# EasyEDA Pro project DCP_main.eprj, board PCB1
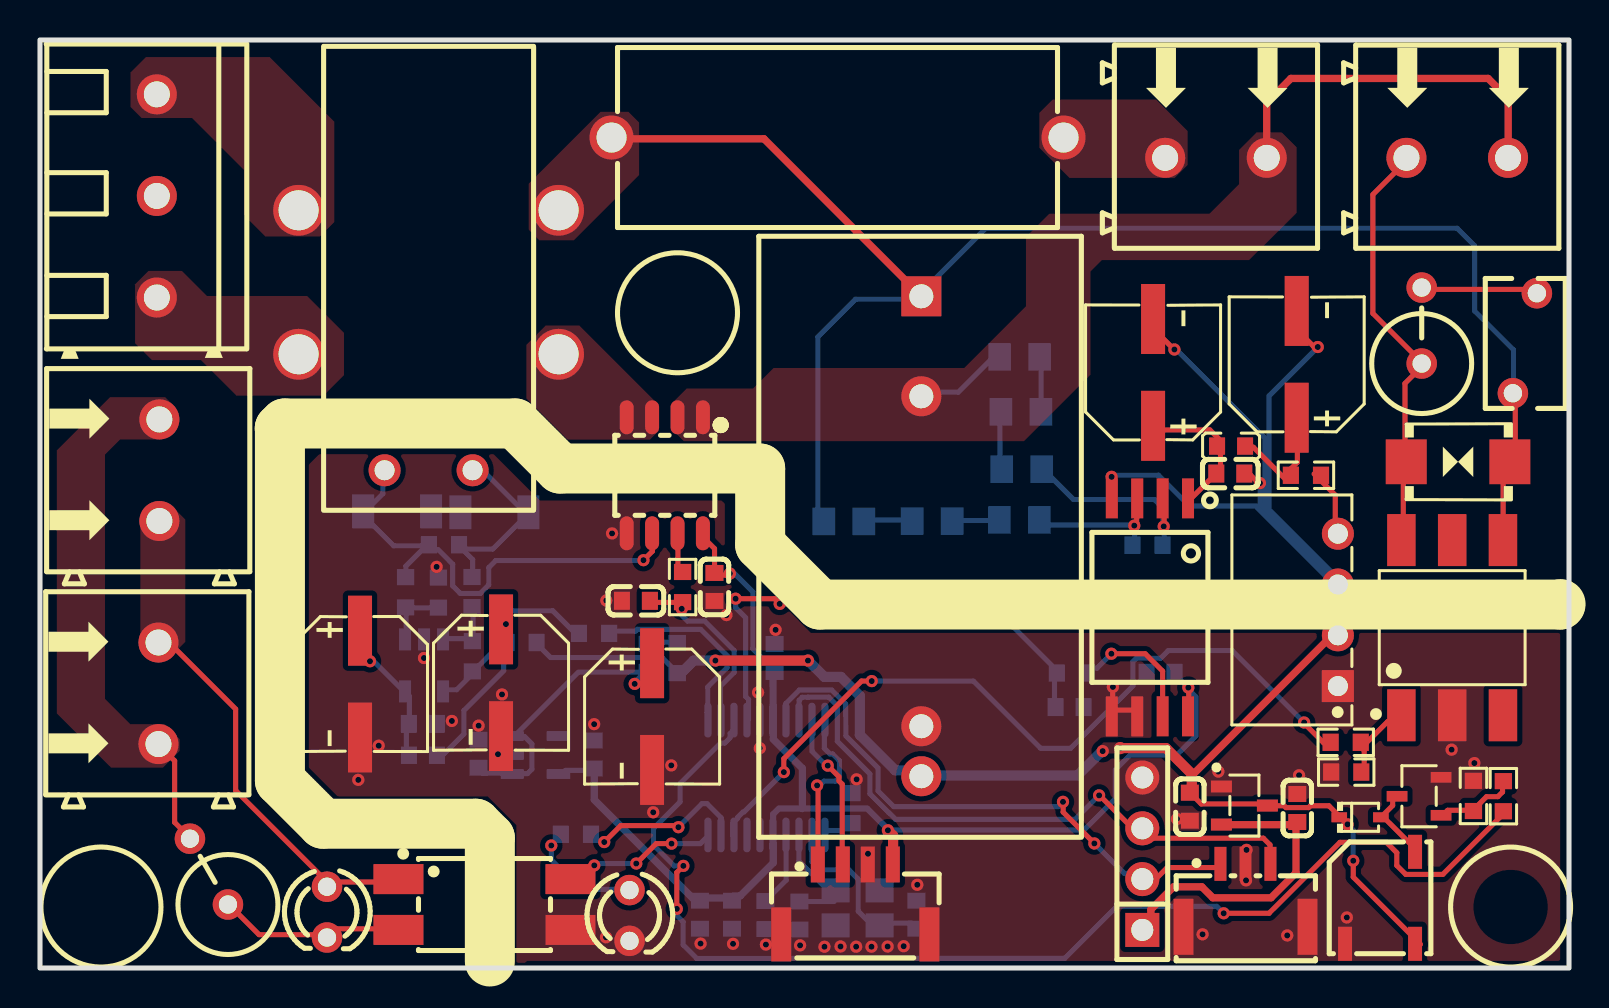
[diagram p2: board, top side]
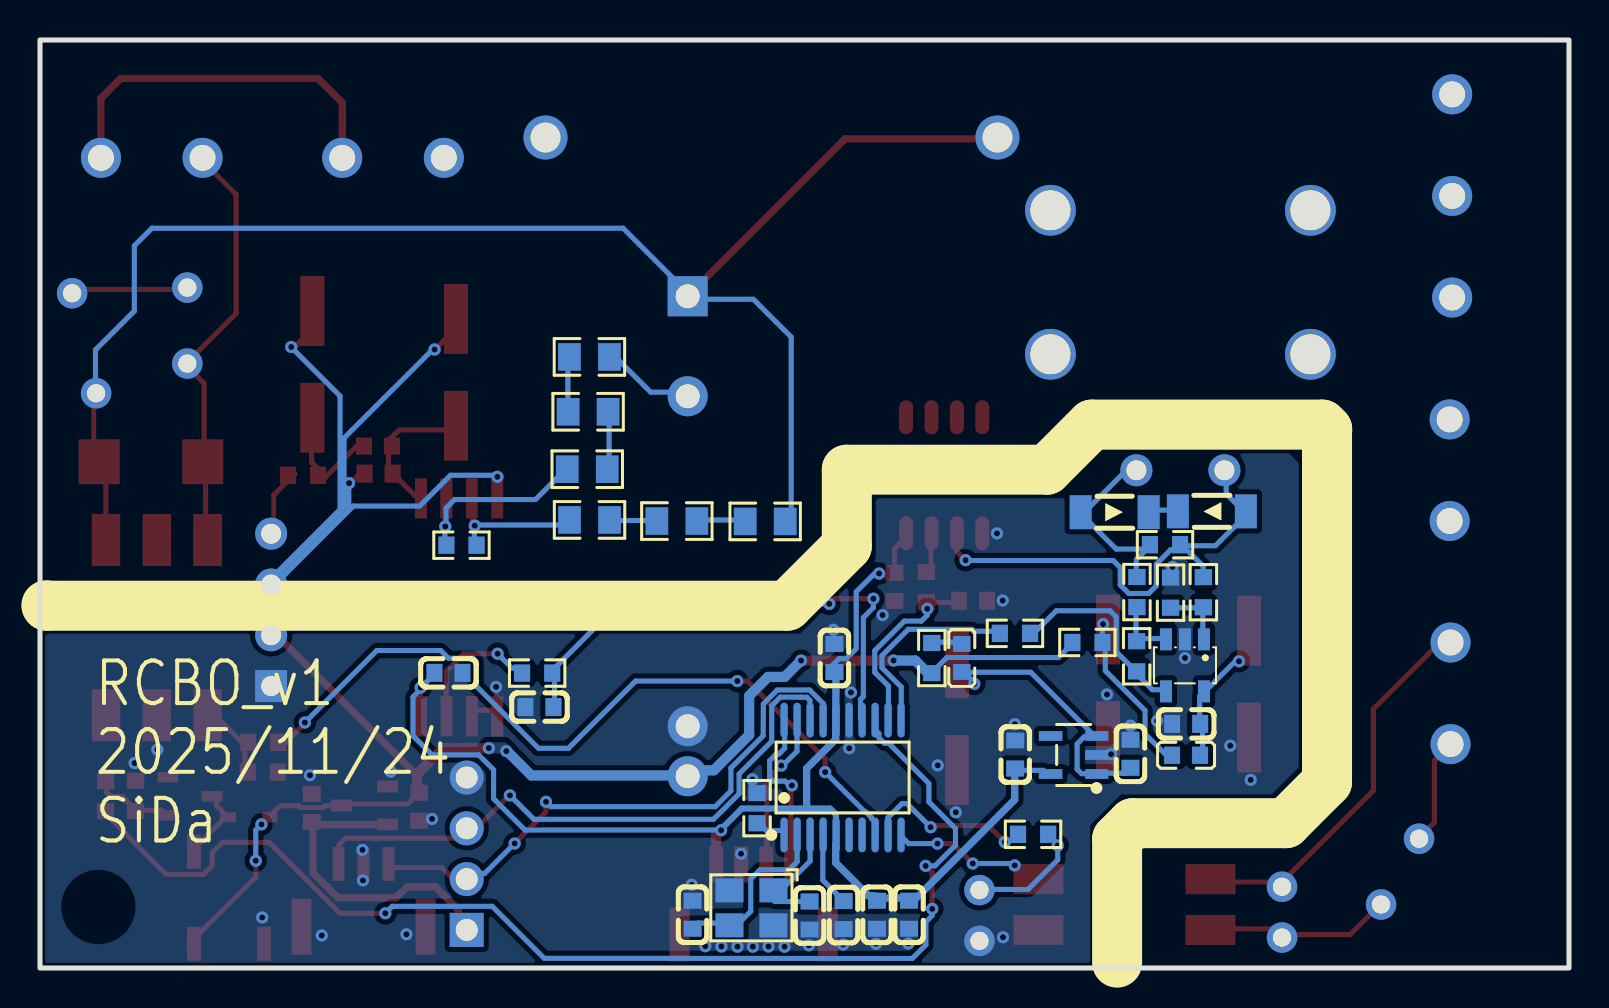
[diagram p3: board, bottom side, seen from below]

Outline 76.45 x 46.41 mm; copper layers: Top Layer, Bottom Layer. Coordinates in mm from the lower left corner of the outline.
Outline path: rectangle 0,46.41 76.45,0
Stack: Top Layer 0.035mm / Dielectric1 1.51mm FR4 er 4.5 / Bottom Layer 0.035mm

## Design rules (mm)
template: 自定义配置
spacing copperThickness1oz (default): track to track 0.102, other pairs 0.152 to 0.3
spacing copperThickness2oz: track to track 0.203, other pairs 0.152 to 0.3
track width copperThickness1oz (default): min 0.127, default 0.254, max 2.54
track width copperThickness2oz: min 0.203, default 0.254, max 2.54
differential pair differentialPair (default): width min 0.127, default 0.254, max 2.54; gap min 0.152, default 0.152
via viaSize (default): diameter min 0.5, default 0.61, max 10; hole min 0.3, default 0.305, max 6.3

## Placement (name value [footprint] x y rotation side)
BLE  -  [HDR-TH_4P-P2.54-V-F]  55.12 5.71 90 top
BUZZER1  4kHz  [BUZ-SMD_L5.0-W5.5-P4.60]  67.01 3.51 90 top
C1  2.2nF  [CAP-TH_L6.5-W4.0-P5.0-D0.5]  74.25 31.24 270 top
C4  100nF  [C0603]  19.14 12.21 0 bottom
C5  100nF  [C0603]  56.03 14.76 0 bottom
C6  220uF  [CAP-SMD_BD6.3-L6.6-W6.6-LS7.4-FD]  62.84 30.19 90 top
C7  220uF  [CAP-SMD_BD6.3-L6.6-W6.6-LS7.4-FD]  55.66 29.78 90 top
C8  220uF  [CAP-SMD_BD6.3-L6.6-W6.6-LS7.4-FD]  23.05 14.26 270 top
C9  220uF  [CAP-SMD_BD6.3-L6.6-W6.6-LS7.4-FD]  16 14.2 270 top
C11  220uF  [CAP-SMD_BD6.3-L6.6-W6.6-LS7.4-FD]  30.61 12.57 270 top
C12  1uF  [C0603]  21.93 10.71 270 bottom
C13  2.2uF  [C0603]  27.69 10.68 270 bottom
C14  100nF  [C0603]  36.28 2.65 90 bottom
C15  20pF  [C0603]  37.97 2.63 90 bottom
C16  20pF  [C0603]  43.82 2.67 270 bottom
C17  100nF  [C0603]  34.6 2.66 270 bottom
C18  4.7uF  [C0603]  33 2.66 270 bottom
C19  100nF  [C0603]  36.73 15.5 270 bottom
C22  100nF  [C0603]  59.52 24.72 0 top
C23  100nF  [C0603]  33.73 19.05 90 top
C24  1nF  [C0603]  29.8 18.36 180 top
C25  1nF  [C0603]  51.48 13.05 0 bottom
C26  10uF  [C0603]  62.87 8 90 top
C27  10uF  [C0603]  57.5 8.07 270 top
CN3  SWD  [CONN-SMD_4P-P1.27_GH125-S04DCA-00]  40.77 3.43 0 top
CN4  WAFER-GH1.25-3PWB  [CONN-TH_3P-P1.25_GH1.25]  60.28 3.63 0 top
CT1  -  [GL-MXNZ06]  19.43 34.29 270 top
D2  ZMM3V3  [LL-34_L3.5-W1.5-RD]  22.72 22.79 0 bottom
D3  ZMM3V3  [LL-34_L3.5-W1.5-RD]  17.86 22.83 180 bottom
D4  SMBJ18CA  [SMB_L4.6-W3.6-LS5.3-BI]  70.91 25.31 0 top
D5  1N4148WS  [SOD-323_L1.7-W1.3-LS2.5-FD]  66.01 7.54 180 top
FH1  PTF-15  [FUSE-TH_L22.0-W9.0-P22.60]  39.88 41.53 0 top
L1  2.5K  [L0603]  59.56 26.1 180 top
L2  2.5K  [L0603]  19.15 10.64 180 bottom
L3  2.5K  [L0603]  30.36 15.51 270 bottom
LED1  -  [LED_TH-3mm]  14.35 2.79 270 top
LED2  HL-304S9AD  [LED-TH_BD3.0-P2.54-FD]  29.48 2.63 270 top
P1  WJ500V-5.08-3P  [CONN-TH_3P-P5.00_WJ500V-5.08-3P]  5.84 38.61 270 top
Q1  S8050  [SOT-23-3_L3.0-W1.7-P0.95-LS2.9-BR]  68.96 8.59 0 top
R1  10K  [RES_MF1W_L_4.5MM]  69.09 30.23 0 top
R3  100K  [R0603]  65.31 9.8 180 top
R4  1K  [R0603]  65.29 11.29 0 top
R5  200  [R0603]  20.2 21.17 180 bottom
R6  47K  [R0805]  48.98 30.56 180 bottom
R7  47K  [R0805]  49.05 27.81 0 bottom
R8  47K  [R0805]  49.09 24.94 180 bottom
R9  47K  [R0805]  48.98 22.41 180 bottom
R10  47K  [R0805]  44.61 22.35 180 bottom
R11  47K  [R0805]  40.19 22.33 180 bottom
R14  3.3K  [R0603]  55.38 21.14 180 bottom
R15  10  [R0603]  51.6 14.75 0 bottom
R16  100K  [R0603]  19.92 18.77 90 bottom
R17  100K  [R0603]  21.62 15.59 90 bottom
R18  1K  [R0603]  18.28 18.79 270 bottom
R19  1K  [R0603]  21.6 18.8 270 bottom
R20  105K  [RES_MF1W_L_4.5MM]  9.4 3.17 30 top
R21  4.7  [R0603]  63.3 24.64 180 top
R22  10  [R0603]  24.08 16.28 180 bottom
R23  2.2  [R0603]  31.86 15.5 90 bottom
R24  10K  [R0603]  40.6 7.99 90 bottom
R25  4.7K  [R0603]  26.8 6.69 0 bottom
R26  10  [R0603]  32.13 19.05 90 top
R27  10  [R0603]  27.7 16.73 0 bottom
R28  4.7K  [R0603]  73.17 8.59 90 top
R29  100K  [R0603]  71.68 8.6 270 top
RLY_COIL  WJ500V-5.08-2P  [CONN-TH_2P-P5.00_WJ500V-5.08-2P]  70.87 40.51 0 top
RLY_IN  WJ500V-5.08-2P  [CONN-TH_2P-P5.00_WJ500V-5.08-2P]  58.8 40.51 0 top
RLY_OUT  WJ500V-5.08-2P  [CONN-TH_2P-P5.00_WJ500V-5.08-2P]  5.97 24.89 90 top
RLY_OUT_PORT  WJ500V-5.08-2P  [CONN-TH_2P-P5.00_WJ500V-5.08-2P]  5.92 13.74 90 top
U1  GD32E230F4P6TR  [TSSOP-20_L6.5-W4.4-P0.65-LS6.4-BL]  36.32 9.52 180 bottom
U3  MOC3063S-TA1  [SMD-6_L7.3-W6.5-P2.54-LS10.2-BL]  70.61 17.02 0 top
U7  LMV321IDBVR  [SOT-23-5_L3.0-W1.7-P0.95-LS2.8-BR]  19.2 15.13 90 bottom
U8  PC817C  [OPTO-SMD-4_L4.6-W6.5-P2.54-LS10.3-TL]  22.23 3.17 0 top
U9  B0505S-1WR3  [PWRM-TH_B0505S-1WR3]  64.9 17.91 90 top
U10  HLK-2M05  [PWRM-TH_HLK-2M05]  44.07 21.59 270 top
U11  XTPS7A2033  [SOT-23-5_L3.0-W1.7-P0.95-LS2.8-BL]  24.77 10.65 90 bottom
U12  CC6920SO-10A  [SOP-8_L5.0-W4.0-P1.27-LS6.2-BL]  31.24 24.64 180 top
U13  AMC1350DWVR  [SOPW8_L7.5-W5.8-P1.27-LS11.5-TL]  55.5 18.03 270 top
U14  SGM2203-3.3YN3LG/TR  [SOT-23-3_L2.9-W1.3-P1.90-LS2.4-BL-3]  60.22 8.12 270 top
X1  8MHz  [OSC-SMD_4P-L3.2-W2.5-BL]  40.88 3.01 0 bottom

## Footprints (pads in the part's own frame, mm; a bottom-side part is the same pattern mirrored in y, then rotated)
BUZ-SMD_L5.0-W5.5-P4.60
  rect 1.7x0.7 smd: 1(-2.3,-1.75) 2(2.3,-1.75) 3(-2.3,1.75)
C0603
  rect 0.8x0.9 smd: 1(-0.7,0) 2(0.7,0)
CAP-SMD_BD6.3-L6.6-W6.6-LS7.4-FD
  rect 3.5x1.2 smd: 1(-2.67,0) 2(2.67,0)
CAP-TH_L6.5-W4.0-P5.0-D0.5
  round 1.524 hole 0.914: 1(-2.5,0.6) 2(2.5,-0.6)
CONN-SMD_4P-P1.27_GH125-S04DCA-00
  rect 0.7x1.8 smd: 1(-1.875,1.75) 2(-0.625,1.75) 3(0.625,1.75) 4(1.875,1.75)
  rect 1x2.7 smd: 5(3.705,-1.75) 6(-3.705,-1.75)
CONN-TH_2P-P5.00_WJ500V-5.08-2P
  round 2 hole 1.3: 1(-2.54,0) 2(2.54,0)
CONN-TH_3P-P1.25_GH1.25
  rect 0.6x1.7 smd: 1(-1.25,1.575) 2(0,1.575) 3(1.25,1.575)
  rect 1x2.8 smd: 4(3.1,-1.575) 5(-3.1,-1.575)
CONN-TH_3P-P5.00_WJ500V-5.08-3P
  round 2 hole 1.3: 1(-5.08,0) 2(0,0) 3(5.08,0)
FUSE-TH_L22.0-W9.0-P22.60
  round 2.2 hole 1.5: 1(-11.3,0) 2(11.3,0)
GL-MXNZ06
  round 2.54 hole 2: 1(-3.6,6.5) 2(-3.6,-6.5) 3(3.6,6.5) 4(3.6,-6.5)
  round 1.6 hole 1: 5(9.4,-2.2) 6(9.4,2.2)
HDR-TH_4P-P2.54-V-F
  rect 1.7x1.7 hole 1.1: 1(-3.81,0)
  round 1.7 hole 1.1: 2(-1.27,0) 3(1.27,0) 4(3.81,0)
L0603
  rect 0.8x0.864 smd: 1(-0.7,0) 2(0.7,0)
LED-TH_BD3.0-P2.54-FD
  round 1.524 hole 0.914: 1(-1.27,0) 2(1.27,0)
LED_TH-3mm
  round 1.524 hole 0.914: 1(-1.27,0) 2(1.27,0)
LL-34_L3.5-W1.5-RD
  rect 1.1x1.7 smd: 1(-1.7,0) 2(1.7,0)
OPTO-SMD-4_L4.6-W6.5-P2.54-LS10.3-TL
  rect 2.5x1.5 smd: 1(-4.3,1.27) 2(-4.3,-1.27) 3(4.3,-1.27) 4(4.3,1.27)
OSC-SMD_4P-L3.2-W2.5-BL
  rect 1.4x1.2 smd: 1(-1.1,-0.875) 2(1.1,-0.875) 3(1.1,0.875) 4(-1.1,0.875)
PWRM-TH_B0505S-1WR3
  rect 1.6x1.6 hole 1: 1(-3.81,0)
  round 1.6 hole 1: 2(-1.27,0) 3(1.27,0) 4(3.81,0)
PWRM-TH_HLK-2M05
  rect 2x2 hole 1.2: 1(-12,0)
  round 2 hole 1.2: 2(-7,0) 3(9.5,0) 4(12,0)
R0603
  rect 0.806x0.864 smd: 1(-0.753,0) 2(0.753,0)
R0805
  rect 1.133x1.377 smd: 1(-1,0) 2(1,0)
RES_MF1W_L_4.5MM
  round 1.524 hole 0.914: 1(0,0) 2(0,3.8)
SMB_L4.6-W3.6-LS5.3-BI
  rect 2.047x2.241 smd: 1(-2.591,0) 2(2.591,0)
SMD-6_L7.3-W6.5-P2.54-LS10.2-BL
  rect 1.423x2.6 smd: 1(-2.54,-4.38) 2(0,-4.38) 3(2.54,-4.38) 4(2.54,4.38) 5(0,4.38) 6(-2.54,4.38)
SOD-323_L1.7-W1.3-LS2.5-FD
  rect 0.78x0.5 smd: 1(-1.04,0) 2(1.04,0)
SOP-8_L5.0-W4.0-P1.27-LS6.2-BL
  oval 0.7x1.7 smd: 1(-1.905,-2.9) 2(-0.635,-2.9) 3(0.635,-2.9) 4(1.905,-2.9) 5(1.905,2.9) 6(0.635,2.9) 7(-0.635,2.9) 8(-1.905,2.9)
SOPW8_L7.5-W5.8-P1.27-LS11.5-TL
  rect 2x0.6 smd: 1(-5.45,1.905) 2(-5.45,0.635) 3(-5.45,-0.635) 4(-5.45,-1.905) 5(5.45,-1.905) 6(5.45,-0.635) 7(5.45,0.635) 8(5.45,1.905)
SOT-23-3_L2.9-W1.3-P1.90-LS2.4-BL-3
  rect 0.6x1.05 smd: 1(-0.95,-1.15) 2(0.95,-1.15) 3(0,1.15)
SOT-23-3_L3.0-W1.7-P0.95-LS2.9-BR
  rect 1.038x0.532 smd: 1(1.101,-0.95) 2(1.101,0.95) 3(-1.101,0)
SOT-23-5_L3.0-W1.7-P0.95-LS2.8-BL
  rect 0.49x1.157 smd: 1(-0.95,-1.153) 2(0,-1.153) 3(0.95,-1.153)
  rect 0.49x1.175 smd: 4(0.95,1.153) 5(-0.95,1.153)
SOT-23-5_L3.0-W1.7-P0.95-LS2.8-BR
  rect 1.1x0.6 smd: 1(1.3,-0.95) 2(1.3,0) 3(1.3,0.95) 4(-1.3,0.95) 5(-1.3,-0.95)
TSSOP-20_L6.5-W4.4-P0.65-LS6.4-BL
  oval 0.364x1.742 smd: 1(-2.925,-2.871) 2(-2.275,-2.871) 3(-1.625,-2.871) 4(-0.975,-2.871) 5(-0.325,-2.871) 6(0.325,-2.871) 7(0.975,-2.871) 8(1.625,-2.871) 9(2.275,-2.871) 10(2.925,-2.871) 11(2.925,2.871) 12(2.275,2.871) 13(1.625,2.871) 14(0.975,2.871) 15(0.325,2.871) 16(-0.325,2.871) 17(-0.975,2.871) 18(-1.625,2.871) 19(-2.275,2.871) 20(-2.925,2.871)

## Nets
As in the schematic.

Pads without a net: U1 6 7; U3 3 5; U11 4

## Via types
v1: diameter 0.61, hole 0.305, Top Layer to Bottom Layer, 82 vias

## Routing (per net, layer and track width the routed paths; a pad name or vN(x,y) marks a point on that pad's centre or on a via; arc(x,y) is an arc through that point)
+3.3V: length 62.5
  Top Layer w0.254: 33.9,19.65 34.42,19.65 v1(34.5,19.73) ; 57.44,13.15 57.44,14.03 57.41,14.06 ; 33.73,19.72 33.73,20.97 33.14,21.56
  Top Layer w0.508: v1(42.4,6.89) 42.66,6.63 42.66,5.49
  Bottom Layer w0.254: 26.1,9.7 26.28,9.88 27.62,9.88 ; 56.88,14.56 57.37,14.07 ; 57.43,13.93 57.8,13.56 57.8,11.61 56.84,10.65 54.51,10.65 53.77,9.91 53.77,8.47 52.2,6.9 42.36,6.9 42.33,7 ; 36.8,14.93 36.8,15.16 36.5,15.47 36.14,15.47 35.64,15.97 35.64,18.81 34.73,19.73 v1(34.5,19.73)
  Bottom Layer w0.305: 36.94,7.97 36.66,7.68 36.66,7.25 ; 36.96,7.97 41.36,7.97 ; 41.36,7.97 42.33,7
  Bottom Layer w0.363: 36.62,14.8 36.7,14.88 ; 32.93,3.49 34.64,3.49 34.7,3.55 ; 27.72,9.94 27.72,8.42 32.77,3.36 ; 36.76,14.74 36.65,14.63 36.67,11.43 38.12,9.98 38.12,7.97 ; 36.67,6.22 36.67,5.26 35.01,3.61 34.7,3.61
  vias: v1(57.42,14.02)
+3.3V_2: length 15
  Top Layer w0.363: 59.11,7.17 62.69,7.17 ; 62.8,7.18 62.8,4.76 61.56,3.51 58.64,3.51 58.09,4.06 56.68,4.06 55.54,2.92 55.54,2.4
+5V: length 62.8
  Top Layer w0.254: 61.35,8.2 58.07,8.2 57.67,8.6 ; 64.94,7.49 65.07,7.49 v1(65.38,7.18) ; v1(65.67,5.36) 65.67,4.55 69.03,1.18 ; 64.95,7.61 64.45,8.11 63.53,8.11 63.43,8.02 62.3,8.02 62.21,8.11 61.46,8.11
  Top Layer w0.363: 64.64,16.39 64.36,16.39 57.59,9.62
  Top Layer w0.508: v1(33.77,15.37) 38.4,15.37 38.42,15.39 ; 54.01,11 56.3,11 57.59,9.7 57.59,8.81
  Bottom Layer w0.254: v1(65.38,7.18) 65.67,6.9 v1(65.67,5.36) ; 24.99,16.06 25.53,15.53 31.1,15.53 31.84,14.79
  Bottom Layer w0.508: 44,9.89 42.76,9.89 40.99,11.65 40.99,13.61 40.05,14.56 39.22,14.56 v1(38.4,15.37) ; 32.08,14.76 32.69,15.37 v1(33.77,15.37) ; 52.98,10.72 51.88,9.63 44.19,9.63
  vias: v1(53.14,10.85) v1(54.01,11)
+5V_1: length 6.6
  Top Layer w0.254: 59.03,26.18 59.03,24.93 58.92,24.82 ; 57.51,23.43 58.66,24.58 58.66,24.62 ; 55.8,26.91 58.5,26.91 59.06,26.35
+5V_2: length 5.6
  Bottom Layer w0.254: v1(16.5,15.34) 16.69,15.34 18.17,13.85 ; 18.39,12.26 18.32,12.18 18.32,10.59 ; 18.32,13.74 18.47,13.59 18.47,12.22
+5V_3: length 14
  Top Layer w0.254: 30.31,14.22 30.29,14.21 29.8,14.21
  Bottom Layer w0.254: 23.65,9.74 22.15,9.74 21.9,9.98 ; 30.17,14.79 26.91,14.79 23.76,11.63 ; 30.22,14.77 29.74,14.28 v1(29.74,14.21) ; 23.89,11.58 24.23,11.58 24.6,11.2 24.6,9.94 24.37,9.72 23.67,9.72
+5V_4: length 3.4
  Top Layer w0.254: 64.77,21.78 64.77,23.65 63.71,24.71
GND: length 2.5
  Top Layer w0.254: 53.56,12.95 53.57,12.95 ; 54.77,12.87 54.75,12.9 53.62,12.9 ; 53.64,13.02 53.64,14.04
  Bottom Layer w0.254: 23.19,10.68 22.91,10.68 v1(22.9,10.69)
  vias: v1(15.92,9.41) v1(16.94,11.12) v1(19.2,15.5) v1(19.83,20.06) v1(20.59,12.35) v1(21.93,12.12) v1(23.1,13.68) v1(27.71,12.19) v1(28.32,18.38) v1(28.3,1.54) v1(28.6,21.73) v1(30.66,7.79) v1(31.57,10.13) v1(33.03,1.22) v1(34.32,17.65) v1(34.65,1.21) v1(35.91,13.78) v1(35.99,10.99) v1(36.3,1.17) v1(36.78,16.91) v1(38.01,1.13) v1(39.23,1.06) v1(40.03,1.08) v1(40.83,9.43) v1(40.81,1.07) v1(41.4,5.71) v1(41.58,1.06) v1(42.38,1.07) v1(43.19,1.09) v1(43.87,4.16) v1(53.65,14.06) v1(56.85,7.45) v1(58.13,1.68) v1(58.92,9.82) v1(60.33,5.91) v1(60.3,4.38) v1(62.36,1.63) v1(62.96,9.64) v1(65.34,2.53) v1(70.58,10.92) v1(71.72,10.25)
GND2: length 46.3
  Top Layer w0.254: 60.86,24.32 60.53,24.65 60.17,24.65 ; 56.72,30.97 56.67,30.97 55.67,31.97 ; 63.08,31.69 63.66,31.11 63.94,31.11
  Bottom Layer w0.254: 64.53,19.61 64.28,19.61 60.79,23.1 57.47,23.1 55.93,24.64 53.7,24.64 53.63,24.57 ; 61.45,22.93 61.25,23.13 61.25,26.5 56.84,30.91 ; 61.45,22.93 64.89,19.49 ; 61.45,22.93 61.45,28.6 63.83,30.98 ; 64.57,19.65 61.02,23.21 61.02,24.23
  vias: v1(53.58,24.56) v1(56.72,30.93) v1(61,24.25) v1(63.89,31.05)
ACIN_ADC: length 25.2
  Top Layer w0.254: v1(36.99,18.21) 36.73,18.47 v1(34.78,18.47)
  Bottom Layer w0.254: v1(34.78,18.47) 34.78,18.02 35.29,17.52 35.29,13.57 35.43,13.43 35.43,12.44 ; 50.76,14.42 50.73,14.4 50.73,13.17 ; 50.88,14.84 47.51,18.21 v1(36.99,18.21)
ACIN_I_ADC: length 9.3
  Top Layer w0.254: 30.3,18.32 30.34,18.28 32.16,18.28
  Bottom Layer w0.254: 34.03,12.42 34.03,14.1 34.71,14.78 34.71,15.87 33.23,17.35 32.38,17.35 32.09,17.64 v1(32.09,17.96)
ACIN_L: length 76.8
  Top Layer w0.254: 73.52,25.26 73.16,24.91 73.16,21.5 ; 73.43,28.65 73.77,28.31 73.77,25.47
  Top Layer w0.363: 29.18,41.46 36.2,41.46 43.91,33.76
  Top Layer w1.27: 28.58,41.46 FH1.1
  Bottom Layer w0.254: 73.68,28.97 73.68,30.91 71.74,32.86 71.74,36.11 70.86,36.99 47.29,36.99 44.47,34.17 ; 38.89,22.4 38.89,31.55 40.78,33.44 43.79,33.44 43.83,33.48
ACIN_N: length 22.2
  Top Layer w0.363: 73.41,40.85 73.41,43.48 72.41,44.48 62.55,44.48 61.34,43.27 61.34,40.64
  Bottom Layer w0.254: 44.47,28.79 45.92,28.79 47.68,30.56
ACOUT_L: length 5.4
  Top Layer w0.254: 7.53,6.49 6.73,7.28 6.73,10.36 5.9,11.19
ACOUT_N: length 19
  Top Layer w0.254: 6.31,16.42 9.78,12.95 9.78,8.88 14.33,4.33 ; 17.76,4.51 17.55,4.3 14.3,4.3
ACOUT_PG: length 6.3
  Top Layer w0.254: v1(29.81,5.22) 30.81,6.22 v1(31.58,6.22)
  Bottom Layer w0.254: 33.4,6.6 33.02,6.22 v1(31.58,6.22) ; v1(27.72,5.13) 27.81,5.22 v1(29.81,5.22)
I_LEAK: length 9.7
  Bottom Layer w0.254: 33.36,12.77 33.39,12.8 33.39,14.05 34.36,15.02 34.36,15.62 33.04,16.93 29.86,16.93 29.77,16.84 28.48,16.84
LEAK_I+: length 8.9
  Bottom Layer w0.254: 21.11,20.95 21.63,20.43 21.63,19.59 ; 21.11,20.95 22.64,20.95 24.38,22.69 ; 21.11,20.95 21.08,20.98 ; 24.23,22.79 22.23,24.79 21.82,24.79
LED1: length 7.6
  Top Layer w0.254: v1(31.92,7.04) 31.91,7.04 31.83,7.12 29.04,7.12 v1(28.21,6.3)
  Bottom Layer w0.254: 34.06,6.91 34.06,7.52 33.35,8.22 33.1,8.22 v1(31.92,7.04)
RLY_COIL: length 39.8
  Top Layer w0.254: 64.42,11.25 64.19,11.25 63.26,12.19 63.26,12.23 v1(63.21,12.28) ; v1(37.19,9.8) 37.19,10.46 41.08,14.35 v1(41.59,14.35)
  Bottom Layer w0.254: v1(63.21,12.28) 59.61,15.88 56.42,15.88 56.03,15.49 54.81,15.49 54.65,15.32 54.65,14.11 51.53,10.99 50.03,10.99 46.67,14.35 v1(41.59,14.35) ; 34.65,6.6 34.65,7.25 34.89,7.49 34.89,7.53 35.16,7.8 35.2,7.8 v1(37.19,9.8)
RX0: length 30.2
  Top Layer w0.254: 55.34,6.75 55.61,6.49 61.17,6.49 61.51,6.16 61.51,5.08 ; 54.38,7.23 52.98,8.63 v1(52.96,8.63)
  Bottom Layer w0.254: 39.87,11.34 39.87,13.12 39.44,13.55 38.41,13.55 38.4,13.54 38.11,13.54 37.96,13.38 37.96,12.35 ; 42.44,7.77 41.5,8.71 41.5,9.7 39.87,11.33 ; v1(52.96,8.63) 52.95,8.63 51.75,7.43 42.78,7.43 42.44,7.77
SWCLK: length 7.9
  Top Layer w0.254: 38.91,5.39 38.91,9.05 38.8,9.16
  Bottom Layer w0.254: 39.22,12 39.22,10.99 39.5,10.7 39.63,10.7 39.97,10.36 39.97,9.88 39.97,9.88 39.97,9.52 39.79,9.34 39.2,9.34 38.91,9.06
  vias: v1(38.86,9.13)
SWDIO: length 7.2
  Top Layer w0.254: 40.11,5.37 40.11,9.19 39.95,9.35 39.95,9.56 v1(39.39,10.12)
  Bottom Layer w0.254: 39.32,10.12 38.6,10.84 38.6,11.95
TIMER2_CH1: length 60
  Top Layer w0.254: v1(31.84,2.96) 31.84,4.78 v1(32.17,5.11) ; 73.11,7.78 73.11,7.64 70.14,4.68 68.29,4.68 67.84,5.13 67.84,5.76 67.33,6.28 ; 67.33,6.28 65,6.28 61.45,2.74 v1(59.19,2.74)
  Bottom Layer w0.254: 53.95,3.08 53.84,3.08 51.24,0.48 32.84,0.48 32.16,1.16 32.16,2.31 31.84,2.62 v1(31.84,2.96) ; v1(59.19,2.74) 58.84,3.08 53.98,3.08 ; v1(32.17,5.11) 31.71,5.11 30.68,6.14 30.68,6.98 32.01,8.3 32.01,9.23 34.03,11.25 34.24,11.25 34.51,11.52 34.51,11.73 34.7,11.92
TX0: length 28.5
  Top Layer w0.254: 52.68,6.27 51.16,7.79 51.16,8.19 ; 55.34,4.26 55.6,4.26 56.36,5.02 58.86,5.02 58.98,5.15
  Bottom Layer w0.254: v1(51.15,8.31) 50.91,8.07 42.69,8.07 41.91,8.86 41.91,10 40.3,11.61 40.28,13.2 39.59,13.9 37.97,13.9 37.28,13.22 37.28,12.33 ; v1(52.72,6.23) 54.22,4.73 54.92,4.73
VREF: length 21.9
  Top Layer w0.254: v1(30.17,20.39) 30.62,20.84 30.62,21.52
  Bottom Layer w0.254: 19.26,21.11 17.68,21.11 16.45,22.34 ; 16.32,22.9 17.14,23.71 17.14,24.75 ; 19.61,20.92 19.91,20.92 20.63,20.2 20.63,19.11 21.02,18.73 22.01,18.73 22.44,19.16 22.44,20.02 22.79,20.38 30.16,20.38 v1(30.17,20.39) ; 18.29,19.57 18.29,20.09 19.18,20.98
$1N1036: length 20.3
  Top Layer w0.254: 69.2,30.18 66.65,32.73 66.65,38.68 68.26,40.29 ; 68.17,21.69 68.17,24.89 68.25,24.97 ; 69.25,30.24 68.25,29.23 68.25,25.47
$1N1457: length 5.6
  Top Layer w0.254: 74.69,33.71 74.46,33.93 69.21,33.93 69.17,33.89
$1N1767: length 3.7
  Top Layer w0.254: 66.21,9.96 66.21,10.89 66.01,11.09 ; 68.16,12.32 67.38,12.32 66.21,11.15
$1N2505: length 1.3
  Bottom Layer w0.254: 20.8,22.79 20.69,22.9 19.54,22.9
$1N3337: length 2.4
  Bottom Layer w0.254: 49.89,30.43 50.06,30.26 50.06,28.14
$1N3339: length 2.2
  Bottom Layer w0.254: 43.41,22.4 41.23,22.4 41.2,22.38
$1N3341: length 2.3
  Bottom Layer w0.254: 45.55,22.38 47.67,22.38 47.78,22.49
$1N3343: length 2.8
  Bottom Layer w0.254: 48.09,27.72 48,27.62 48,24.93
$1N4877: length 6.5
  Top Layer w0.254: 56.14,12.61 56.14,14.84 55.26,15.72 v1(53.57,15.72)
  Bottom Layer w0.254: 52.53,14.99 52.85,14.99 v1(53.57,15.72)
$1N5300: length 2.8
  Bottom Layer w0.254: 20.25,16.38 20.34,16.47 21.55,16.47 ; 21.65,17.94 21.65,16.51 ; 21.58,16.44 21.58,16.44
$1N5307: length 9.4
  Bottom Layer w0.254: 20.29,13.92 20.83,13.92 21.64,14.72 ; 21.75,14.93 22.64,15.82 22.64,17.56 22.95,17.87 25.64,17.87 26.75,16.75
$1N5316: length 3.2
  Bottom Layer w0.254: 18.31,18.01 19.91,18.01 19.98,18.09 ; 18.31,17.87 18.31,16.57 18.16,16.42
$1N5629: length 9.5
  Top Layer w0.254: 18.47,1.96 14.8,1.96 14.55,1.71 ; 14.34,1.67 10.95,1.67 9.49,3.13
$1N6158: length 4.8
  Top Layer w0.254: 62.87,26.74 62.87,25.29 62.23,24.65 ; 60.59,26.04 60.67,26.04 62.34,24.37
$1N6428: length 7.9
  Bottom Layer w0.254: 20.01,10.7 20.2,10.7 21.2,11.71 21.2,12.88 23.19,14.86 23.19,16.17 ; v1(23.3,17.2) 23.33,17.16 23.33,16.16
$1N6591: length 1.3
  Bottom Layer w0.254: 31.75,16.31 31.73,16.29 30.43,16.29
$1N7664: length 8.2
  Bottom Layer w0.254: 43.83,1.98 43.57,2.24 41.93,2.24 ; 38.59,6.17 38.59,5.32 39,4.91 40.44,4.91 40.92,4.44 40.92,2.84 41.69,2.06
$1N7665: length 5.1
  Bottom Layer w0.254: 39.72,3.32 37.97,3.32 ; 37.95,6.1 37.95,5.35 39.61,3.68 39.61,3.41
$1N7667: length 1.3
  Bottom Layer w0.254: 39.3,6.88 40.13,6.88 40.48,7.23
$1N7674: length 3.4
  Bottom Layer w0.254: 36.31,3.39 37.31,4.39 37.31,6.31 37.29,6.33
$1N7687: length 5.2
  Bottom Layer w0.254: v1(25.57,6.13) 25.57,5.41 27.05,3.93 29.48,3.93
$1N12357: length 6.7
  Top Layer w0.254: 54.84,23.38 54.84,22.25 54.75,22.16
  Bottom Layer w0.254: 54.55,21.2 54.74,21.38 54.74,22.01 ; 50.12,22.29 50.26,22.15 54.66,22.15
  vias: v1(54.72,22.12)
$1N12365: length 9.1
  Top Layer w0.254: 56.21,23.08 56.21,22.11
  Bottom Layer w0.254: 56.15,22.13 56.15,23 55.72,23.43 51.68,23.43 50.32,24.78 ; 56.21,21.23 56.21,21.95
  vias: v1(56.19,22.08)
$1N12518: length 1.8
  Top Layer w0.254: 31.9,21.57 31.9,20.07 32.12,19.84
$1N13672: length 3.9
  Top Layer w0.254: 67.64,8.58 67.64,8.13 66.96,7.45 ; 68.89,5.83 67.26,7.47 67.13,7.47
$1N13840: length 3.8
  Top Layer w0.254: 71.76,7.89 70.39,7.89 70.17,7.66 ; 71.71,7.94 72.33,8.57 72.9,8.57 73.13,8.8 73.13,9.12

## Copper pours and planes (outline as drawn; the poured copper is in the pictures)
GND on Top Layer: 23.82,0.24 23.82,7.14 22.38,8.58 14.88,8.58 13.44,10.02 13.44,25.17 13.96,25.69 22.68,25.69 25,23.38 34.08,23.38 34.24,23.22 34.24,21.06 38.55,16.76 76.01,16.76 76.01,0.35 24.36,0.35 24.24,0.24 23.82,0.24
GND on Bottom Layer: 23.94,7.14 22.4,8.68 14.86,8.68 13.51,10.03 13.51,25.25 14,25.73 22.64,25.73 24.88,23.49 34.55,23.49 34.66,23.38 34.66,20.48 38.43,16.71 76.09,16.71 76.2,16.6 76.2,0.07 76.2,0.07 24.02,0.07 23.94,0.15
ACIN_L on Top Layer: 24.44,42.82 29.96,42.82 29.96,36.39 24.44,36.39
ACIN_N on Top Layer: 31.6,41.79 62.84,41.79 62.84,26.34 31.6,26.34
ACOUT_L on Top Layer: 0.84,28.54 6.98,28.54 6.98,10.02 0.84,10.02
ACOUT_N on Top Layer: 5.02,22.88 7.26,22.88 7.26,15.39 5.02,15.39
$1N739 on Top Layer: 49.97,43.43 57.38,43.43 57.38,39.5 49.97,39.5
$1N2417 on Top Layer: 4.52,45.55 14.72,45.55 14.72,36.58 4.52,36.58
$1N4891 on Top Layer: 4.73,34.86 15.2,34.86 15.2,28.62 4.73,28.62
$1N13107 on Top Layer: 24.32,32.13 30.95,32.13 30.95,26.42 24.32,26.42

Small or netless copper shapes (teardrops, artwork), in the pictures only: 1 on Top Layer, 1 on Bottom Layer

## Text on the board
Bottom Silkscreen Layer: RCBO_v1 / 2025/11/24 / SiDa
